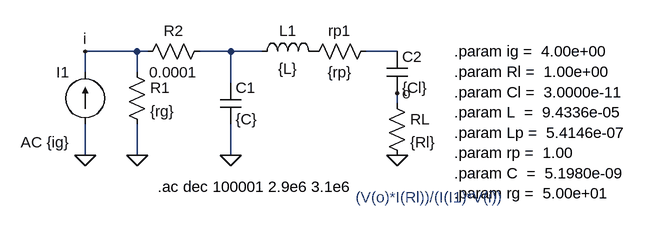
[diagram p0: schematic adaptadorL_ant_conPerdidas.asc]
adaptadorL_ant_conPerdidas.asc, the LTspice schematic file:
Version 4
SHEET 1 880 680
WIRE 32 64 -48 64
WIRE 48 64 32 64
WIRE 176 64 128 64
WIRE 224 64 176 64
WIRE 432 64 384 64
WIRE -48 96 -48 64
WIRE 32 96 32 64
WIRE 176 112 176 64
WIRE 432 144 432 128
WIRE -48 224 -48 176
WIRE 32 224 32 176
WIRE 176 224 176 176
FLAG 432 224 0
FLAG 176 224 0
FLAG 32 224 0
FLAG -48 224 0
FLAG -48 64 i
FLAG 432 128 o
SYMBOL current -48 176 R180
WINDOW 0 24 80 Left 2
WINDOW 3 24 0 Left 2
WINDOW 123 24 -28 Left 2
WINDOW 39 0 0 Left 0
SYMATTR InstName I1
SYMATTR Value ""
SYMATTR Value2 AC {ig}
SYMBOL res 16 80 R0
SYMATTR InstName R1
SYMATTR Value {rg}
SYMBOL cap 160 112 R0
SYMATTR InstName C1
SYMATTR Value {C}
SYMATTR SpiceLine Rser=0
SYMBOL ind 208 80 R270
WINDOW 0 32 56 VTop 2
WINDOW 3 5 56 VBottom 2
SYMATTR InstName L1
SYMATTR Value {L}
SYMATTR SpiceLine Rser=0
SYMBOL res 416 128 R0
SYMATTR InstName RL
SYMATTR Value {Rl}
SYMBOL cap 416 64 R0
SYMATTR InstName C2
SYMATTR Value {Cl}
SYMBOL res 400 48 R90
WINDOW 0 0 56 VBottom 2
WINDOW 3 32 56 VTop 2
SYMATTR InstName rp1
SYMATTR Value {rp}
SYMBOL res 144 48 R90
WINDOW 0 0 56 VBottom 2
WINDOW 3 32 56 VTop 2
SYMATTR InstName R2
SYMATTR Value 0.0001
TEXT 64 272 Left 2 !.ac dec 100001 2.9e6 3.1e6
TEXT 520 64 Left 2 !.param ig =  4.00e+00 \n.param Rl =  1.00e+00 \n.param Cl =  3.0000e-11 \n.param L  =  9.4336e-05 \n.param Lp =  5.4146e-07 \n.param rp =  1.00 \n.param C  =  5.1980e-09 \n.param rg =  5.00e+01
TEXT 368 288 Left 2 ;(V(o)*I(Rl))/(I(I1)*V(i))

The netlist it stands for:
* adaptadorL_ant_conPerdidas.asc
I1 0 i AC {ig}
R1 i 0 {rg}
C1 N001 0 {C} Rser=0
L1 N001 P001 {L} Rser=0
RL o 0 {Rl}
C2 N002 o {Cl}
rp1 N002 P001 {rp}
R2 N001 i 0.0001
.ac dec 100001 2.9e6 3.1e6
.param ig =  4.00e+00
.param Rl =  1.00e+00
.param Cl =  3.0000e-11
.param L  =  9.4336e-05
.param Lp =  5.4146e-07
.param rp =  1.00
.param C  =  5.1980e-09
.param rg =  5.00e+01
* (V(o)*I(Rl))/(I(I1)*V(i))
.backanno
.end